# Altium schematic sheet Nguyen_Ly.SchDoc
size A; SheetNumber: 1; SheetTotal: 1
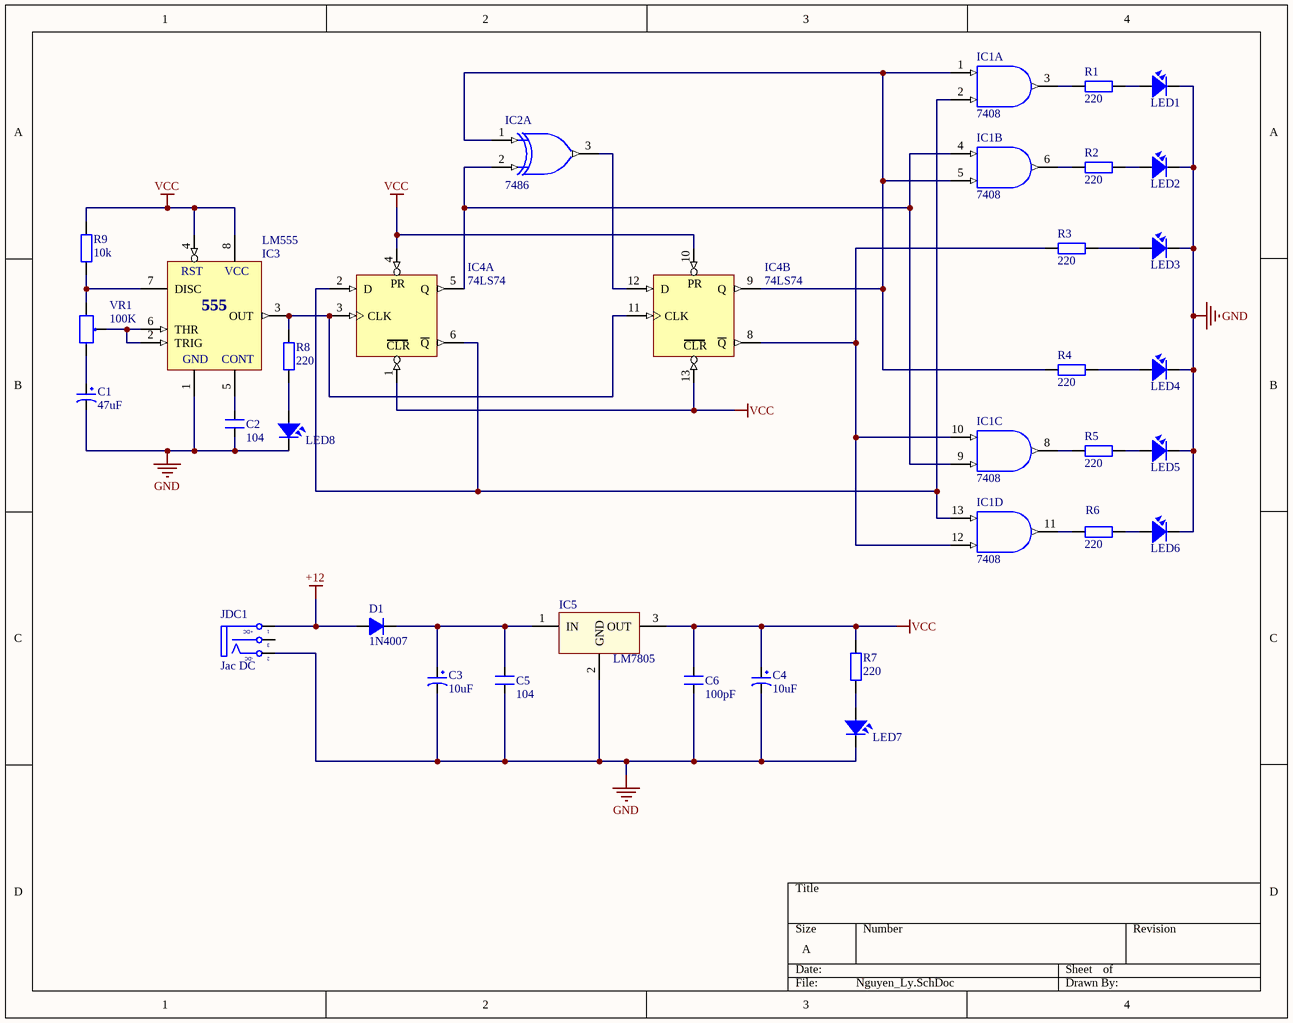
[diagram p0: Nguyen_Ly.SchDoc]

## Parts
C1  47uF  [CP1/2]
C2  104  [CN1]
C3  10uF  [CP1/2]
C4  10uF  [CP1/2]
C5  104  [CN1]
C6  100pF  [CN1]
D1  1N4007  [D1A]
IC1  7408  [DIP14/W0.3]  (parts A,B,C,D of 4)
IC2  7486  [DIP14/W0.3]  (part A of 4)
IC3  LM555  [DIP8/W0.3]
IC4  74LS74  [DIP14/W0.3]  (parts A,B of 2)
IC5  LM7805  [QTO-220]
JDC1  Jac DC  [DC-IN]
LED1  LED  [LED-5-Green]  (value not drawn)
LED2  LED  [LED-5-Yellow]  (value not drawn)
LED3  LED  [LED-5-RED]  (value not drawn)
LED4  LED  [LED-5-RED]  (value not drawn)
LED5  LED  [LED-5-Yellow]  (value not drawn)
LED6  LED  [LED-5-Green]  (value not drawn)
LED7  LED  [LED-5-WHITE]  (value not drawn)
LED8  LED  [LED-5-WHITE]  (value not drawn)
R1  220  [R1/4W]
R2  220  [R1/4W]
R3  220  [R1/4W]
R4  220  [R1/4W]
R5  220  [R1/4W]
R6  220  [R1/4W]
R7  220  [R1/4W]
R8  220  [R1/4W]
R9  10k  [R1/4W]
VR1  100K  [VR]

## Nets
+12: D1.1(A) JDC1.1(T)
GND: C1.2 C2.1 C3.2 C4.2 C5.1 C6.1 IC1.7(GND) IC2.7(GND) IC3.1(GND) IC4.7(GND) IC5.2(GND) JDC1.2(TN) LED1.2 LED2.2 LED3.2 LED4.2 LED5.2 LED6.2 LED7.2 LED8.2
VCC: C4.1 C6.2 IC1.14(VCC) IC3.4(RST) IC3.8(VCC) IC4.1(CLR) IC4.4(PR) IC4.10(PR) IC4.13(CLR) IC4.14(VCC) IC5.3(OUT) R7.1 R9.2
VDD: IC2.14(VDD)
NetC1_1: C1.1 VR1.3
NetC2_2: C2.2 IC3.5(CONT)
NetC3_1: C3.1 C5.2 D1.2(K) IC5.1(IN)
NetIC1_1: IC1.1(A) IC1.5(B) IC2.1(A) IC4.9(Q) R4.2
NetIC1_2: IC1.2(B) IC1.13(A) IC4.2(D) IC4.6(~{Q})
NetIC1_3: IC1.3(O) R1.2
NetIC1_4: IC1.4(A) IC1.9(B) IC2.2(B) IC4.5(Q)
NetIC1_6: IC1.6(O) R2.2
NetIC1_8: IC1.8(O) R5.2
NetIC1_10: IC1.10(A) IC1.12(B) IC4.8(~{Q}) R3.2
NetIC1_11: IC1.11(O) R6.2
NetIC2_3: IC2.3(Y) IC4.12(D)
NetIC3_2: IC3.2(TRIG) IC3.6(THR) VR1.2
NetIC3_3: IC3.3(OUT) IC4.3(CLK) IC4.11(CLK) R8.2
NetIC3_7: IC3.7(DISC) R9.1 VR1.1
NetLED1_1: LED1.1 R1.1
NetLED2_1: LED2.1 R2.1
NetLED3_1: LED3.1 R3.1
NetLED4_1: LED4.1 R4.1
NetLED5_1: LED5.1 R5.1
NetLED6_1: LED6.1 R6.1
NetLED7_1: LED7.1 R7.2
NetLED8_1: LED8.1 R8.1

Not connected (* = marked no-connect by the designer): JDC1 3(S)

## Notes on the sheet
- (in symbol DCIN) +DC; -DC
- (in symbol LM555) 555

## Library data of the parts
C1 C3 C4 = CP1: Cap P  0,1uF < 22uF , 16 - 50V; Value: 10uF/50V; Description 1: 10 => 220uF/6,3V/10V - 10uF => 100uF/16V; Description 2: 0,1uF => 33uF/50V - 10uF => 22uF/63V; Description 3: 0,47uF => 10uF/100V
C2 C5 = CN1: Cap np  1pF - 472pF; Value: 100pF
C6 = CN1: Cap np  1pF - 472pF; Value: 100pF
D1 = D1A: Diode 1A; Value: 1N4007
IC1 = 7408: Quad 2-Input AND Gate; Value: 7408
IC2 = 7486: Quad 2-Input XOR Gate; Value: 7486; Copyright by: VanDungEvn@Gmail.com
IC3 = LM555: Timer; Value: LM555
IC4 = 7474: Dual D Flip-Flop; Value: 74LS74; Copyright by: VanDungEvn@Gmail.com
IC5 = LM78xx: On ap +, from + 5 to + 24VDC; Value: LM7805
JDC1 = DCIN: Jac DC input; Value: Jac DC
LED1-LED8 = LED: LED Single colour Green and Red; Value: LED 3 ly Single Colour
R1-R9 = R1/4W: Resistor 1/4W; Value: R1/4W - 1K
VR1 = VR: Var Resistor; Value: VR 10K